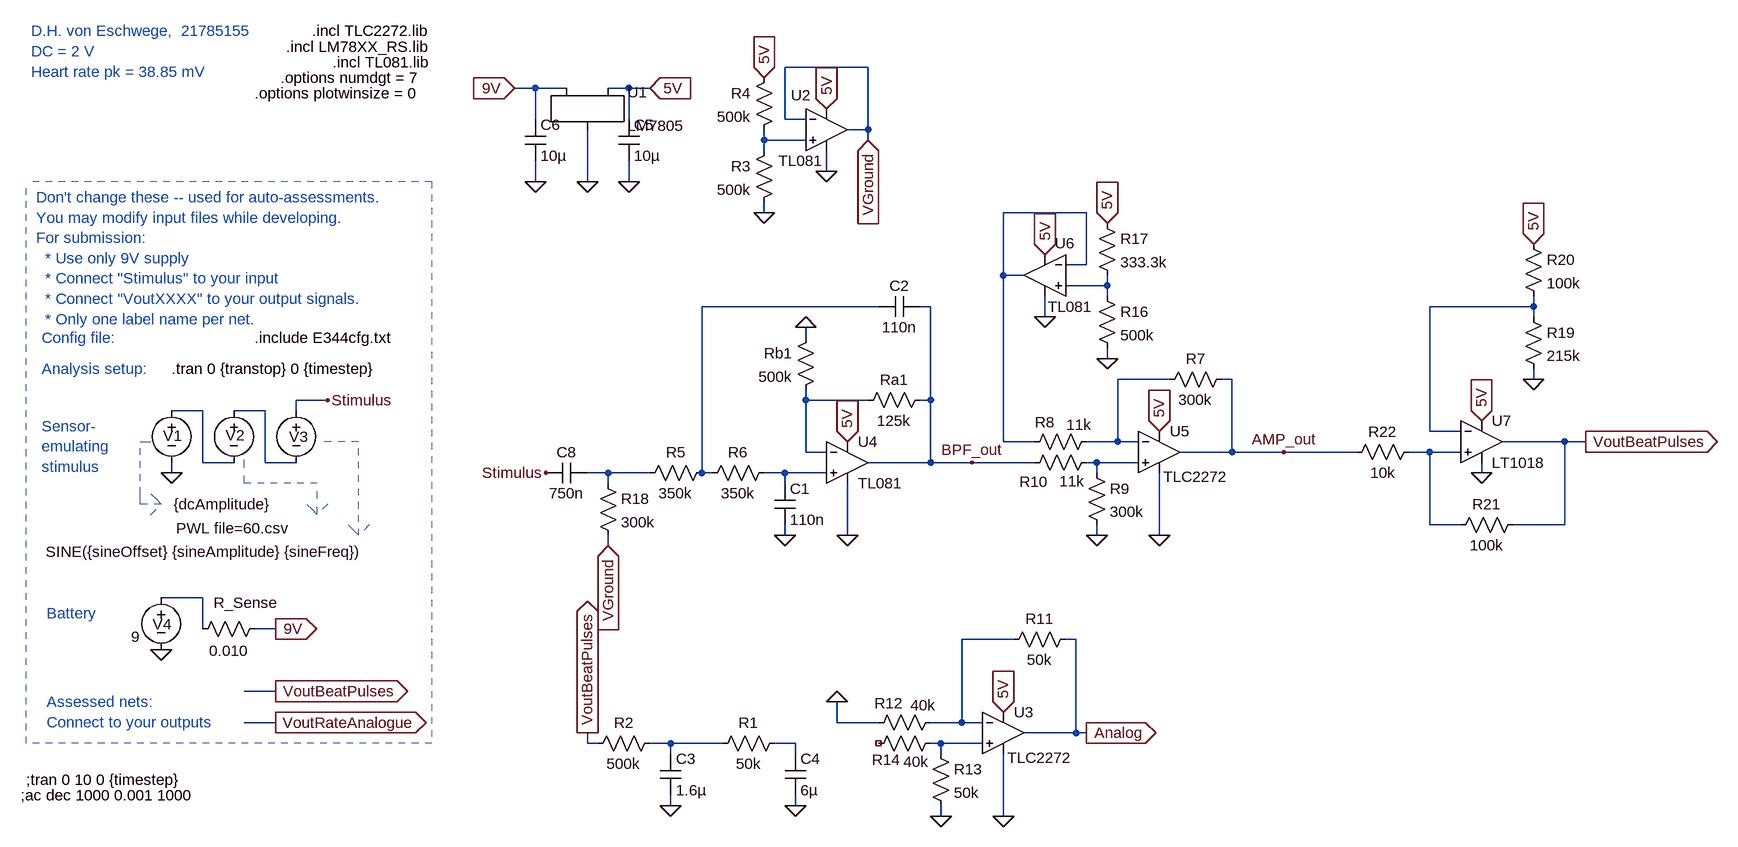
[diagram p0: schematic final.asc]
final.asc, the LTspice schematic file:
Version 4
SHEET 1 1824 680
WIRE -1008 -1584 -1136 -1584
WIRE -1520 -1552 -1552 -1552
WIRE -1472 -1552 -1520 -1552
WIRE -1376 -1552 -1408 -1552
WIRE -1344 -1552 -1376 -1552
WIRE -1520 -1504 -1520 -1552
WIRE -1376 -1504 -1376 -1552
WIRE -1136 -1504 -1136 -1584
WIRE -1104 -1504 -1136 -1504
WIRE -1008 -1488 -1008 -1584
WIRE -1008 -1488 -1040 -1488
WIRE -1168 -1472 -1168 -1488
WIRE -1104 -1472 -1168 -1472
WIRE -1008 -1472 -1008 -1488
WIRE -1168 -1456 -1168 -1472
WIRE -1072 -1424 -1072 -1456
WIRE -1520 -1408 -1520 -1440
WIRE -1440 -1408 -1440 -1488
WIRE -1376 -1408 -1376 -1440
WIRE -1168 -1360 -1168 -1376
WIRE -672 -1360 -800 -1360
WIRE -672 -1280 -672 -1360
WIRE -672 -1280 -704 -1280
WIRE -800 -1264 -800 -1360
WIRE -768 -1264 -800 -1264
WIRE -640 -1248 -640 -1264
WIRE -640 -1248 -704 -1248
WIRE -640 -1232 -640 -1248
WIRE -992 -1216 -1264 -1216
WIRE -912 -1216 -928 -1216
WIRE 16 -1216 16 -1232
WIRE 16 -1216 -144 -1216
WIRE -736 -1200 -736 -1232
WIRE 16 -1200 16 -1216
WIRE -1104 -1168 -1104 -1184
WIRE -640 -1136 -640 -1152
WIRE -544 -1104 -624 -1104
WIRE -448 -1104 -464 -1104
WIRE 16 -1104 16 -1120
WIRE -1840 -1072 -1888 -1072
WIRE -1104 -1072 -1104 -1088
WIRE -1008 -1072 -1104 -1072
WIRE -912 -1072 -912 -1216
WIRE -912 -1072 -928 -1072
WIRE -2032 -1056 -2080 -1056
WIRE -1936 -1056 -1984 -1056
WIRE -1888 -1056 -1888 -1072
WIRE -144 -1024 -144 -1216
WIRE -96 -1024 -144 -1024
WIRE -800 -1008 -800 -1264
WIRE -752 -1008 -800 -1008
WIRE -624 -1008 -624 -1104
WIRE -624 -1008 -672 -1008
WIRE -592 -1008 -624 -1008
WIRE 64 -1008 -32 -1008
WIRE 96 -1008 64 -1008
WIRE -1104 -992 -1104 -1072
WIRE -1072 -992 -1104 -992
WIRE -448 -992 -448 -1104
WIRE -448 -992 -528 -992
WIRE -368 -992 -448 -992
WIRE -256 -992 -368 -992
WIRE -144 -992 -176 -992
WIRE -96 -992 -144 -992
WIRE -2032 -976 -2032 -1056
WIRE -1984 -976 -2032 -976
WIRE -1936 -976 -1936 -1056
WIRE -1888 -976 -1936 -976
WIRE -912 -976 -912 -1072
WIRE -912 -976 -1008 -976
WIRE -848 -976 -912 -976
WIRE -752 -976 -848 -976
WIRE -656 -976 -672 -976
WIRE -592 -976 -656 -976
WIRE -2080 -960 -2080 -976
WIRE -1408 -960 -1440 -960
WIRE -1344 -960 -1408 -960
WIRE -1264 -960 -1264 -1216
WIRE -1248 -960 -1264 -960
WIRE -1136 -960 -1168 -960
WIRE -1072 -960 -1136 -960
WIRE -656 -960 -656 -976
WIRE -64 -960 -64 -976
WIRE -1408 -944 -1408 -960
WIRE -1136 -944 -1136 -960
WIRE -144 -880 -144 -992
WIRE -96 -880 -144 -880
WIRE 64 -880 64 -1008
WIRE 64 -880 -16 -880
WIRE -1136 -864 -1136 -880
WIRE -1040 -864 -1040 -944
WIRE -656 -864 -656 -880
WIRE -560 -864 -560 -960
WIRE -1408 -848 -1408 -864
WIRE -2032 -768 -2096 -768
WIRE -2032 -720 -2032 -768
WIRE -1920 -720 -1952 -720
WIRE -784 -704 -864 -704
WIRE -688 -704 -704 -704
WIRE -1920 -624 -1968 -624
WIRE -1920 -576 -1968 -576
WIRE -1056 -576 -1056 -608
WIRE -992 -576 -1056 -576
WIRE -864 -576 -864 -704
WIRE -864 -576 -912 -576
WIRE -832 -576 -864 -576
WIRE -688 -560 -688 -704
WIRE -688 -560 -768 -560
WIRE -672 -560 -688 -560
WIRE -1440 -544 -1440 -560
WIRE -1424 -544 -1440 -544
WIRE -1312 -544 -1344 -544
WIRE -1232 -544 -1312 -544
WIRE -1120 -544 -1152 -544
WIRE -896 -544 -912 -544
WIRE -832 -544 -896 -544
WIRE -1312 -528 -1312 -544
WIRE -1120 -528 -1120 -544
WIRE -896 -528 -896 -544
WIRE -1312 -448 -1312 -464
WIRE -1120 -448 -1120 -464
WIRE -896 -432 -896 -448
WIRE -800 -432 -800 -528
FLAG -2080 -960 0
FLAG -1840 -1072 Stimulus
FLAG -1920 -720 9V
IOPIN -1920 -720 Out
FLAG -2096 -688 0
FLAG -1920 -624 VoutBeatPulses
IOPIN -1920 -624 Out
FLAG -1920 -576 VoutRateAnalogue
IOPIN -1920 -576 Out
FLAG -1440 -1408 0
FLAG -1552 -1552 9V
IOPIN -1552 -1552 In
FLAG -1520 -1408 0
FLAG -1376 -1408 0
FLAG -1344 -1552 5V
IOPIN -1344 -1552 In
FLAG -1168 -1360 0
FLAG -1168 -1568 5V
IOPIN -1168 -1568 In
FLAG -1072 -1424 0
FLAG -1072 -1520 5V
IOPIN -1072 -1520 In
FLAG -1008 -1472 VGround
IOPIN -1008 -1472 In
FLAG -1312 -448 0
FLAG -1040 -864 0
FLAG -1136 -864 0
FLAG -1104 -1184 0
FLAG -1040 -1008 5V
IOPIN -1040 -1008 In
FLAG -560 -864 0
FLAG -656 -864 0
FLAG -848 -976 BPF_out
FLAG -640 -1136 0
FLAG -640 -1344 5V
IOPIN -640 -1344 In
FLAG -736 -1200 0
FLAG -560 -1024 5V
IOPIN -560 -1024 In
FLAG -64 -1040 5V
IOPIN -64 -1040 In
FLAG -64 -960 0
FLAG -1504 -960 Stimulus
FLAG -368 -992 AMP_out
FLAG 16 -1104 0
FLAG 16 -1312 5V
IOPIN 16 -1312 In
FLAG -1408 -848 VGround
IOPIN -1408 -848 In
FLAG -736 -1296 5V
IOPIN -736 -1296 In
FLAG -1440 -560 VoutBeatPulses
IOPIN -1440 -560 Out
FLAG 96 -1008 VoutBeatPulses
IOPIN 96 -1008 Out
FLAG -1120 -448 0
FLAG -672 -560 Analog
IOPIN -672 -560 Out
FLAG -800 -432 0
FLAG -896 -432 0
FLAG -800 -592 5V
IOPIN -800 -592 In
FLAG -1056 -608 0
SYMBOL voltage -1984 -1072 R0
WINDOW 123 0 0 Left 0
WINDOW 39 0 0 Left 0
WINDOW 3 -89 197 Left 2
WINDOW 0 -13 54 Left 2
SYMATTR Value PWL file=60.csv
SYMATTR InstName V2
SYMBOL voltage -1888 -1072 R0
WINDOW 123 24 44 Left 2
WINDOW 39 0 0 Left 0
WINDOW 3 -386 233 Left 2
WINDOW 0 -11 56 Left 2
SYMATTR Value SINE({sineOffset} {sineAmplitude} {sineFreq})
SYMATTR InstName V3
SYMBOL voltage -2080 -1072 R0
WINDOW 123 0 0 Left 0
WINDOW 39 0 0 Left 0
WINDOW 3 3 160 Left 2
WINDOW 0 -13 55 Left 2
SYMATTR Value {dcAmplitude}
SYMATTR InstName V1
SYMBOL voltage -2096 -784 R0
WINDOW 123 24 44 Left 2
WINDOW 39 0 0 Left 0
WINDOW 3 -46 76 Left 2
WINDOW 0 -13 57 Left 2
SYMATTR Value 9
SYMATTR InstName V4
SYMBOL res -1936 -736 R90
WINDOW 0 -9 30 VBottom 2
WINDOW 3 34 56 VTop 2
SYMATTR InstName R_Sense
SYMATTR Value 0.010
SYMBOL res -1328 -560 R90
WINDOW 0 0 56 VBottom 2
WINDOW 3 32 56 VTop 2
SYMATTR InstName R2
SYMATTR Value 500k
SYMBOL LM7805 -1440 -1536 R0
SYMATTR InstName U1
SYMBOL cap -1392 -1504 R0
SYMATTR InstName C5
SYMATTR Value 10µ
SYMBOL cap -1536 -1504 R0
SYMATTR InstName C6
SYMATTR Value 10µ
SYMBOL res -1152 -1472 M0
SYMATTR InstName R3
SYMATTR Value 500k
SYMBOL res -1152 -1584 M0
SYMATTR InstName R4
SYMATTR Value 500k
SYMBOL Opamps\\opamp2 -1072 -1552 R0
WINDOW 0 -55 11 Left 2
WINDOW 3 -74 112 Left 2
SYMATTR InstName U2
SYMATTR Value TL081
SYMBOL cap -1328 -528 R0
SYMATTR InstName C3
SYMATTR Value 1.6µ
SYMBOL res -1248 -976 R90
WINDOW 0 0 56 VBottom 2
WINDOW 3 32 56 VTop 2
SYMATTR InstName R5
SYMATTR Value 350k
SYMBOL cap -1152 -944 R0
SYMATTR InstName C1
SYMATTR Value 110n
SYMBOL Opamps\\opamp2 -1040 -1040 R0
SYMATTR InstName U4
SYMATTR Value TL081
SYMBOL res -1152 -976 R90
WINDOW 0 0 56 VBottom 2
WINDOW 3 32 56 VTop 2
SYMATTR InstName R6
SYMATTR Value 350k
SYMBOL res -912 -1088 R90
WINDOW 0 0 56 VBottom 2
WINDOW 3 32 56 VTop 2
SYMATTR InstName Ra1
SYMATTR Value 125k
SYMBOL res -1088 -1184 M0
SYMATTR InstName Rb1
SYMATTR Value 500k
SYMBOL cap -928 -1232 R90
WINDOW 0 0 32 VBottom 2
WINDOW 3 32 32 VTop 2
SYMATTR InstName C2
SYMATTR Value 110n
SYMBOL res -448 -1120 R90
WINDOW 0 0 56 VBottom 2
WINDOW 3 32 56 VTop 2
SYMATTR InstName R7
SYMATTR Value 300k
SYMBOL res -656 -1024 R90
WINDOW 0 2 80 VBottom 2
WINDOW 3 -26 27 VTop 2
SYMATTR InstName R8
SYMATTR Value 11k
SYMBOL Opamps\\opamp2 -560 -1056 R0
WINDOW 3 6 102 Left 2
SYMATTR Value TLC2272
SYMATTR InstName U5
SYMBOL res -672 -976 R0
SYMATTR InstName R9
SYMATTR Value 300k
SYMBOL res -656 -992 R90
WINDOW 0 61 97 VBottom 2
WINDOW 3 29 38 VTop 2
SYMATTR InstName R10
SYMATTR Value 11k
SYMBOL res -656 -1248 R0
SYMATTR InstName R16
SYMATTR Value 500k
SYMBOL res -656 -1360 R0
SYMATTR InstName R17
SYMATTR Value 333.3k
SYMBOL Opamps\\opamp2 -736 -1328 M0
WINDOW 0 -46 15 Left 2
WINDOW 3 -74 112 Left 2
SYMATTR InstName U6
SYMATTR Value TL081
SYMBOL Comparators\\LT1018 -64 -1008 R0
SYMATTR InstName U7
SYMBOL cap -1440 -944 M270
WINDOW 0 32 32 VTop 2
WINDOW 3 0 32 VBottom 2
SYMATTR InstName C8
SYMATTR Value 750n
SYMBOL res -1424 -960 R0
SYMATTR InstName R18
SYMATTR Value 300k
SYMBOL res 0 -1216 R0
SYMATTR InstName R19
SYMATTR Value 215k
SYMBOL res 0 -1328 R0
SYMATTR InstName R20
SYMATTR Value 100k
SYMBOL res 0 -896 R90
WINDOW 0 0 56 VBottom 2
WINDOW 3 32 56 VTop 2
SYMATTR InstName R21
SYMATTR Value 100k
SYMBOL res -160 -1008 R90
WINDOW 0 0 56 VBottom 2
WINDOW 3 32 56 VTop 2
SYMATTR InstName R22
SYMATTR Value 10k
SYMBOL res -1136 -560 R90
WINDOW 0 0 56 VBottom 2
WINDOW 3 32 56 VTop 2
SYMATTR InstName R1
SYMATTR Value 50k
SYMBOL cap -1136 -528 R0
SYMATTR InstName C4
SYMATTR Value 6µ
SYMBOL res -688 -720 R90
WINDOW 0 0 56 VBottom 2
WINDOW 3 32 56 VTop 2
SYMATTR InstName R11
SYMATTR Value 50k
SYMBOL res -896 -592 R90
WINDOW 0 2 80 VBottom 2
WINDOW 3 -26 27 VTop 2
SYMATTR InstName R12
SYMATTR Value 40k
SYMBOL Opamps\\opamp2 -800 -624 R0
WINDOW 3 6 102 Left 2
SYMATTR Value TLC2272
SYMATTR InstName U3
SYMBOL res -912 -544 R0
SYMATTR InstName R13
SYMATTR Value 50k
SYMBOL res -896 -560 R90
WINDOW 0 57 84 VBottom 2
WINDOW 3 29 38 VTop 2
SYMATTR InstName R14
SYMATTR Value 40k
TEXT -2080 -1120 Left 2 !.tran 0 {transtop} 0 {timestep}
TEXT -1952 -1168 Left 2 !.include E344cfg.txt
TEXT -2288 -1384 Left 2 ;Don't change these -- used for auto-assessments.\nYou may modify input files while developing.\nFor submission: \n  * Use only 9V supply \n  * Connect "Stimulus" to your input\n  * Connect "VoutXXXX" to your output signals.\n  * Only one label name per net.
TEXT -2280 -1168 Left 2 ;Config file:
TEXT -2280 -1120 Left 2 ;Analysis setup:
TEXT -2272 -744 Left 2 ;Battery
TEXT -2280 -1032 Left 2 ;Sensor-\nemulating \nstimulus
TEXT -2272 -608 Left 2 ;Assessed nets:\nConnect to your outputs
TEXT -2296 -1640 Left 2 ;D.H. von Eschwege,  21785155\nDC = 2 V\nHeart rate pk = 38.85 mV
TEXT -1864 -1640 Left 2 !.incl TLC2272.lib
TEXT -1904 -1616 Left 2 !.incl LM78XX_RS.lib
TEXT -1832 -1592 Left 2 !.incl TL081.lib
TEXT -1912 -1568 Left 2 !.options numdgt = 7
TEXT -1952 -1544 Left 2 !.options plotwinsize = 0
TEXT -2312 -464 Left 2 !;ac dec 1000 0.001 1000
TEXT -2304 -488 Left 2 !;tran 0 10 0 {timestep}
LINE Normal -1792 -1008 -1856 -1008 2
LINE Normal -1792 -864 -1792 -1008 2
LINE Normal -1808 -880 -1792 -864 2
LINE Normal -1792 -864 -1808 -880 2
LINE Normal -1776 -880 -1792 -864 2
LINE Normal -2128 -1008 -2112 -1008 2
LINE Normal -2128 -928 -2128 -1008 2
LINE Normal -2128 -912 -2128 -928 2
LINE Normal -2096 -912 -2128 -912 2
LINE Normal -2112 -928 -2096 -912 2
LINE Normal -2096 -912 -2112 -928 2
LINE Normal -2112 -896 -2096 -912 2
LINE Normal -1968 -944 -1968 -992 2
LINE Normal -1856 -944 -1968 -944 2
LINE Normal -1856 -896 -1856 -944 2
LINE Normal -1872 -912 -1856 -896 2
LINE Normal -1856 -896 -1872 -912 2
LINE Normal -1840 -912 -1856 -896 2
LINE Normal -2304 -544 -2304 -1408 1
LINE Normal -1680 -1408 -1680 -544 1
LINE Normal -1680 -544 -2304 -544 1
LINE Normal -1680 -1408 -2304 -1408 1

The netlist it stands for:
* final.asc
V2 N009 N008 PWL file=60.csv
V3 Stimulus N009 SINE({sineOffset} {sineAmplitude} {sineFreq})
V1 N008 0 {dcAmplitude}
V4 N014 0 9
R_Sense 9V N014 0.010
R2 N016 VoutBeatPulses 500k
XU1 9V 0 5V LM7805
C5 5V 0 10µ
C6 9V 0 10µ
R3 N001 0 500k
R4 5V N001 500k
XU2 N001 VGround 5V 0 VGround TL081  ; pins In+ In- V+ V- OUT
C3 N016 0 1.6µ
R5 N004 N012 350k
C1 N013 0 110n
XU4 N013 N007 5V 0 BPF_out TL081  ; pins In+ In- V+ V- OUT
R6 N013 N004 350k
Ra1 BPF_out N007 125k
Rb1 0 N007 500k
C2 BPF_out N004 110n
R7 AMP_out N006 300k
R8 N006 N002 11k
XU5 N011 N006 5V 0 AMP_out TLC2272  ; pins In+ In- V+ V- OUT
R9 N011 0 300k
R10 N011 BPF_out 11k
R16 N003 0 500k
R17 5V N003 333.3k
XU6 N003 N002 5V 0 N002 TL081  ; pins In+ In- V+ V- OUT
XU7 N010 N005 5V 0 VoutBeatPulses LT1018  ; pins In+ In- V+ V- OUT
C8 N012 Stimulus 750n
R18 N012 VGround 300k
R19 N005 0 215k
R20 5V N005 100k
R21 VoutBeatPulses N010 100k
R22 N010 AMP_out 10k
R1 N017 N016 50k
C4 N017 0 6µ
R11 Analog N015 50k
R12 N015 0 40k
XU3 N018 N015 5V 0 Analog TLC2272  ; pins In+ In- V+ V- OUT
R13 N018 0 50k
R14 N018 NC_01 40k
.tran 0 {transtop} 0 {timestep}
.include E344cfg.txt
* Don't change these -- used for auto-assessments.
* You may modify input files while developing.
* For submission:
*   * Use only 9V supply
*   * Connect "Stimulus" to your input
*   * Connect "VoutXXXX" to your output signals.
*   * Only one label name per net.
* Config file:
* Analysis setup:
* Battery
* Sensor-
* emulating
* stimulus
* Assessed nets:
* Connect to your outputs
* D.H. von Eschwege,  21785155
* DC = 2 V
* Heart rate pk = 38.85 mV
.incl TLC2272.lib
.incl LM78XX_RS.lib
.incl TL081.lib
.options numdgt = 7
.options plotwinsize = 0
;ac dec 1000 0.001 1000
;tran 0 10 0 {timestep}
.lib LTC1.lib
.backanno
.end